# EAGLE board mmu6100x (EAGLE 6.6.0), part 1 of 2
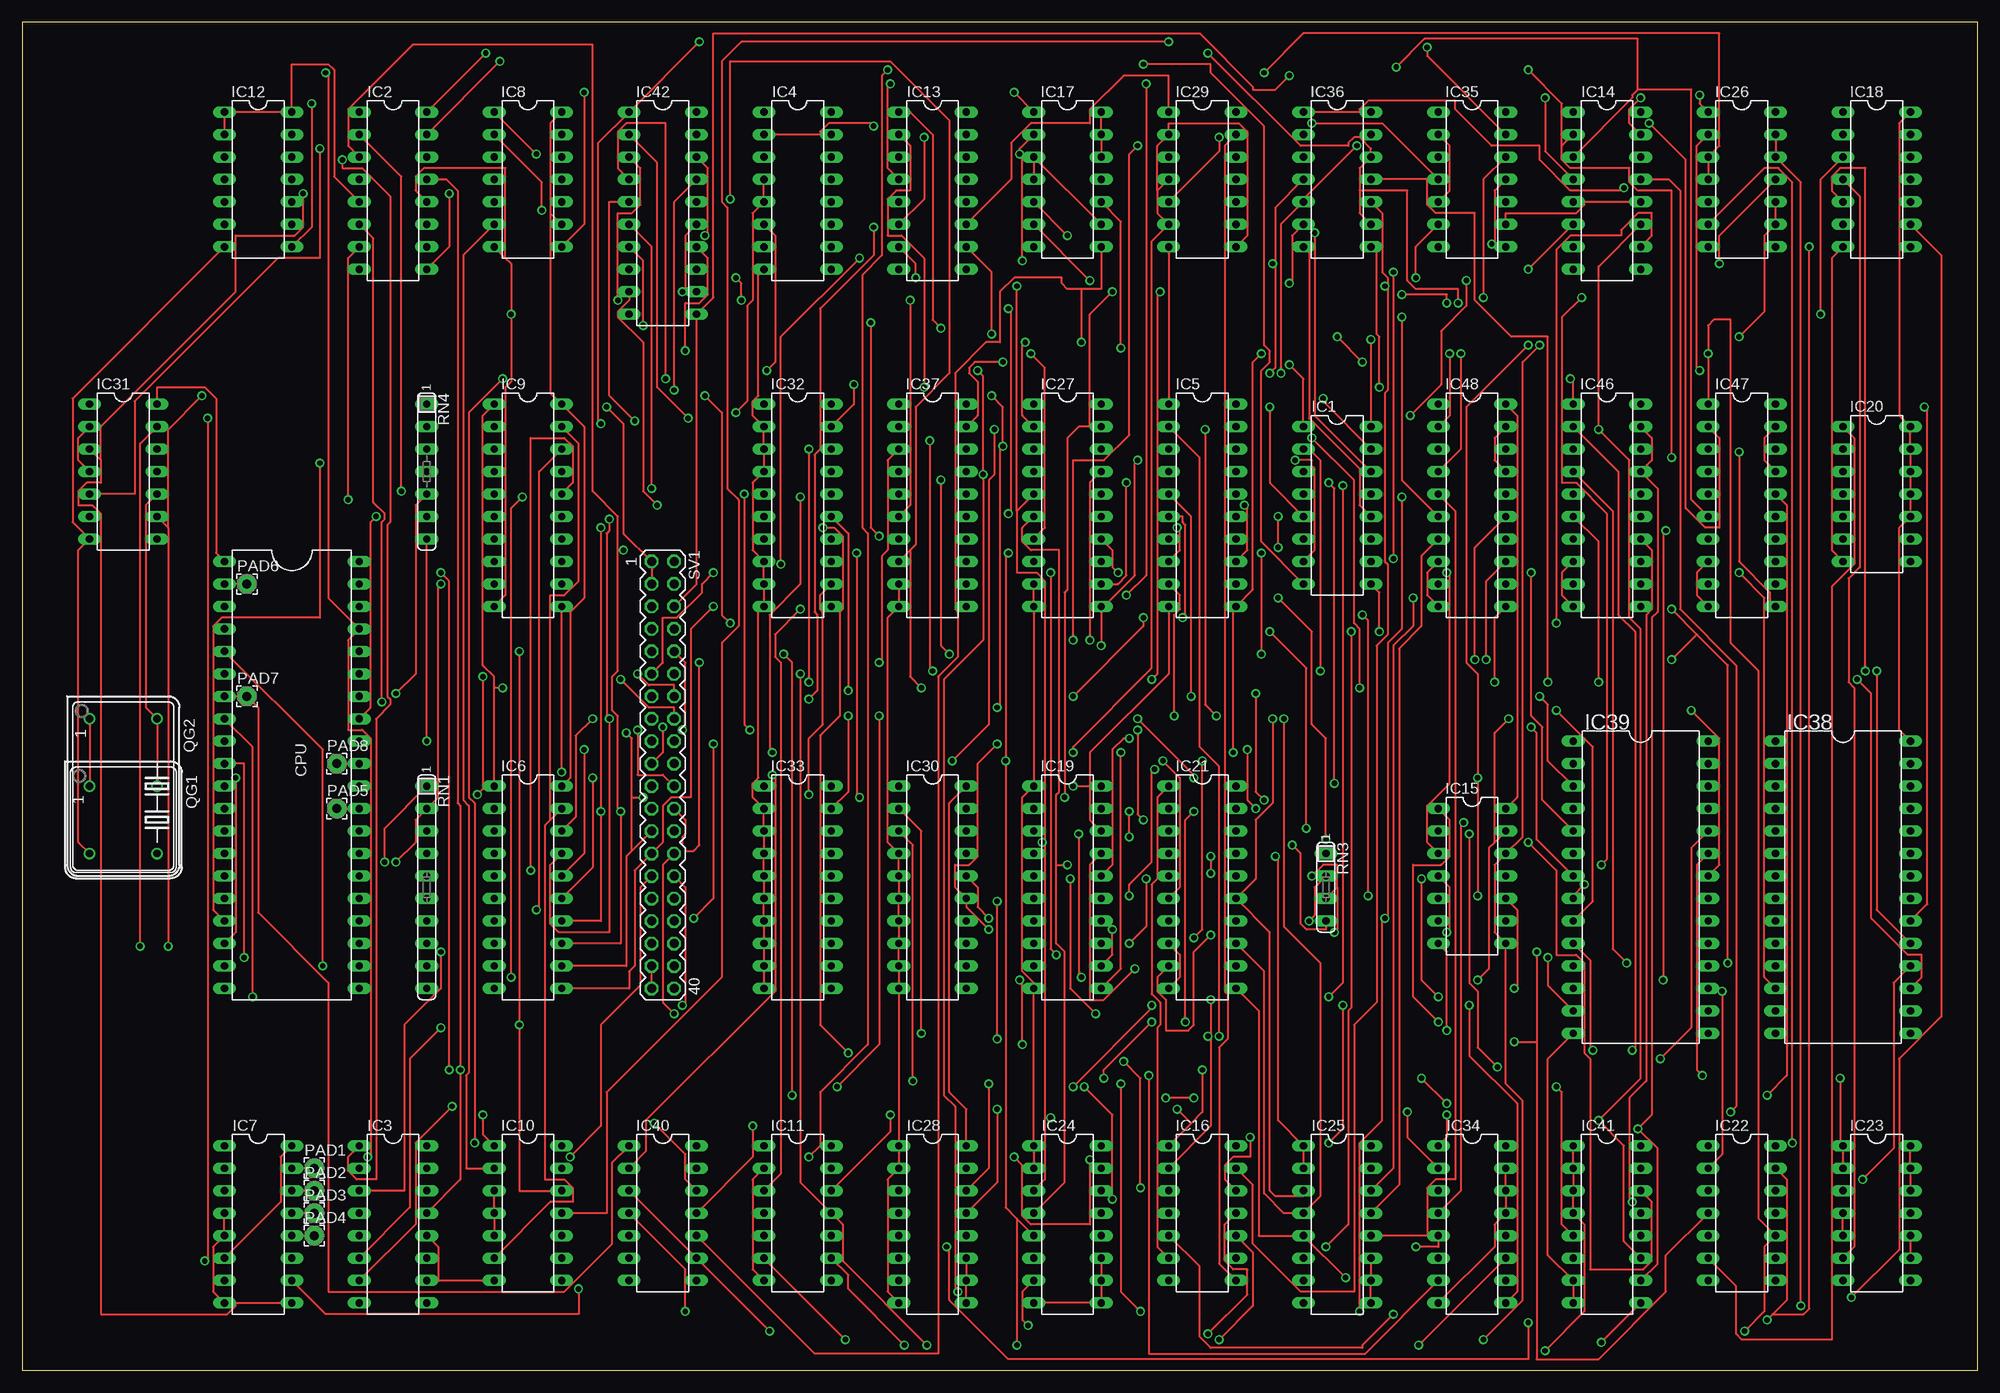
[diagram p3: board, top side]
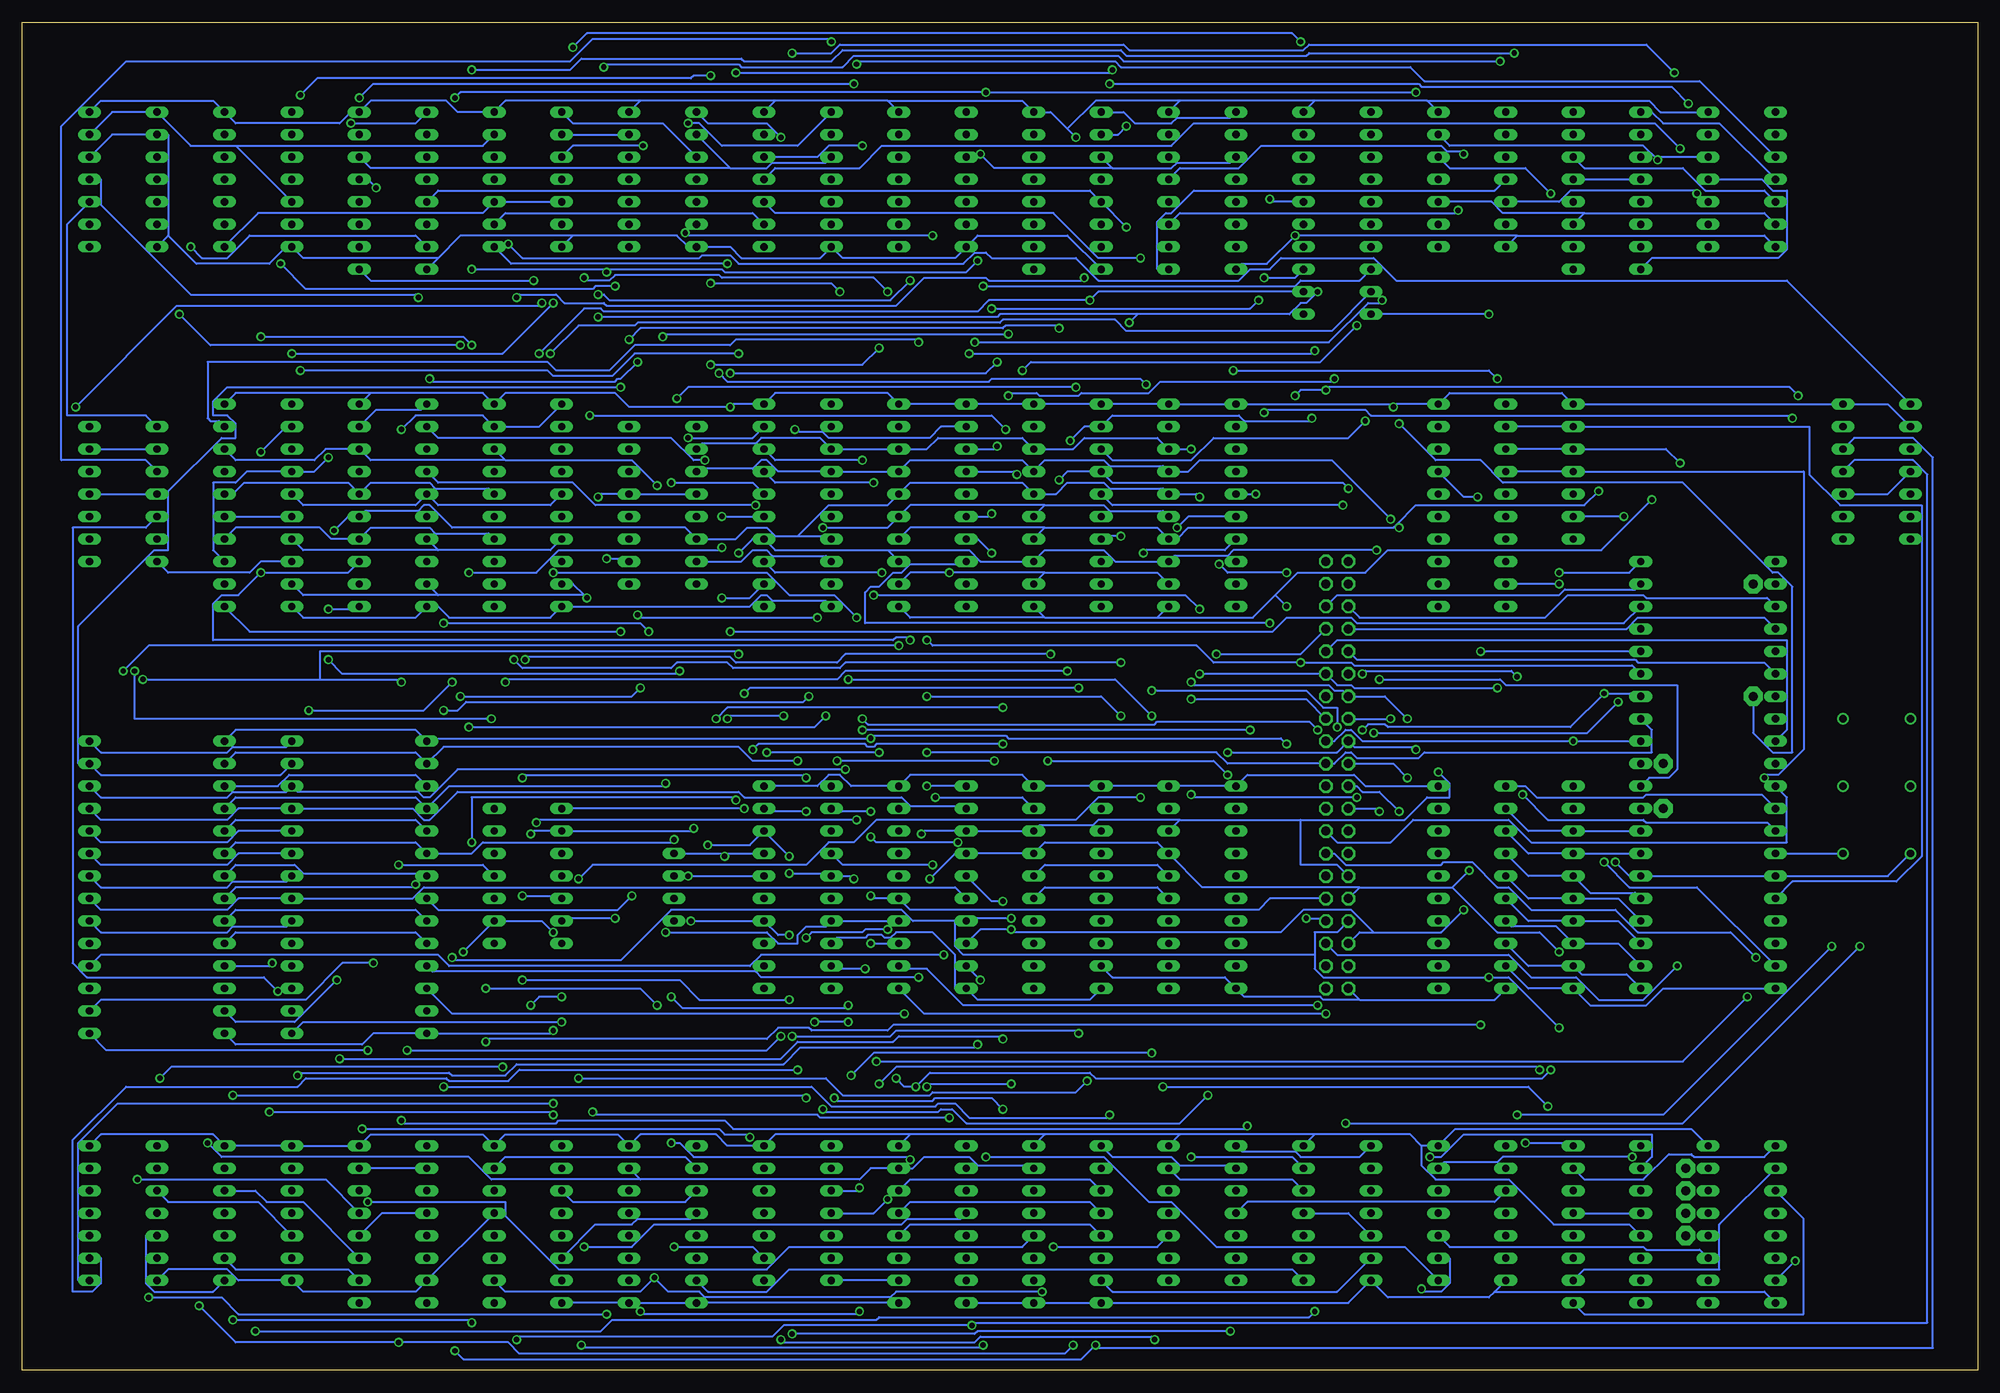
[diagram p4: board, bottom side, seen from below]

Size 220.98 x 152.4 mm. Coordinates in mm from the lower left corner, seen from the top.
Outline: 0,0 220.98,0 220.98,152.4 0,152.4 0,0
Copper layers (1*16): Top 0.035mm / dielectric 1.5mm / Bottom 0.035mm
Design rules "8mils *": minimum track width 10mil, minimum drill 24mil, track to track 8mil, track to pad 8mil, pad to pad 8mil, via to via 8mil, smd to smd 8mil, copper to edge 40mil, drill to drill 10mil, minimum pad ring 10mil, minimum via ring 8mil, stop-mask expansion 0mil, vias tented up to drill 0mil, thermal gap 10mil

## Footprints (pad centres in the part's own frame; a part is rotated, then mirrored left to right if it is on the bottom)
DIL40 = drill 0.813 long: 1 -24.13,-7.62; 2 -21.59,-7.62; 3 -19.05,-7.62; 4 -16.51,-7.62; 5 -13.97,-7.62; 6 -11.43,-7.62; 7 -8.89,-7.62; 8 -6.35,-7.62; 9 -3.81,-7.62; 10 -1.27,-7.62; 11 1.27,-7.62; 12 3.81,-7.62; 13 6.35,-7.62; 14 8.89,-7.62; 15 11.43,-7.62; 16 13.97,-7.62; 17 16.51,-7.62; 18 19.05,-7.62; 19 21.59,-7.62; 20 24.13,-7.62; 21 24.13,7.62; 22 21.59,7.62; 23 19.05,7.62; 24 16.51,7.62; 25 13.97,7.62; 26 11.43,7.62; 27 8.89,7.62; 28 6.35,7.62; 29 3.81,7.62; 30 1.27,7.62; 31 -1.27,7.62; 32 -3.81,7.62; 33 -6.35,7.62; 34 -8.89,7.62; 35 -11.43,7.62; 36 -13.97,7.62; 37 -16.51,7.62; 38 -19.05,7.62; 39 -21.59,7.62; 40 -24.13,7.62
DIL16 = drill 0.813 long: 1 -8.89,-3.81; 2 -6.35,-3.81; 3 -3.81,-3.81; 4 -1.27,-3.81; 5 1.27,-3.81; 6 3.81,-3.81; 7 6.35,-3.81; 8 8.89,-3.81; 9 8.89,3.81; 10 6.35,3.81; 11 3.81,3.81; 12 1.27,3.81; 13 -1.27,3.81; 14 -3.81,3.81; 15 -6.35,3.81; 16 -8.89,3.81
DIL20 = drill 0.813 long: 1 -11.43,-3.81; 2 -8.89,-3.81; 3 -6.35,-3.81; 4 -3.81,-3.81; 5 -1.27,-3.81; 6 1.27,-3.81; 7 3.81,-3.81; 8 6.35,-3.81; 9 8.89,-3.81; 10 11.43,-3.81; 11 11.43,3.81; 12 8.89,3.81; 13 6.35,3.81; 14 3.81,3.81; 15 1.27,3.81; 16 -1.27,3.81; 17 -3.81,3.81; 18 -6.35,3.81; 19 -8.89,3.81; 20 -11.43,3.81
DIL14 = drill 0.813 long: 1 -7.62,-3.81; 2 -5.08,-3.81; 3 -2.54,-3.81; 4 0,-3.81; 5 2.54,-3.81; 6 5.08,-3.81; 7 7.62,-3.81; 8 7.62,3.81; 9 5.08,3.81; 10 2.54,3.81; 11 0,3.81; 12 -2.54,3.81; 13 -5.08,3.81; 14 -7.62,3.81
DIL28-6 = drill 0.813 long: 1 -16.51,-7.62; 2 -13.97,-7.62; 3 -11.43,-7.62; 4 -8.89,-7.62; 5 -6.35,-7.62; 6 -3.81,-7.62; 7 -1.27,-7.62; 8 1.27,-7.62; 9 3.81,-7.62; 10 6.35,-7.62; 11 8.89,-7.62; 12 11.43,-7.62; 13 13.97,-7.62; 14 16.51,-7.62; 15 16.51,7.62; 16 13.97,7.62; 17 11.43,7.62; 18 8.89,7.62; 19 6.35,7.62; 20 3.81,7.62; 21 1.27,7.62; 22 -1.27,7.62; 23 -3.81,7.62; 24 -6.35,7.62; 25 -8.89,7.62; 26 -11.43,7.62; 27 -13.97,7.62; 28 -16.51,7.62
2,15/1,0 = drill 1.016 pad 2.159 octagon: 1 0,0
DIL08S = drill 0.813: 1 -3.81,-3.81; 4 3.81,-3.81; 5 3.81,3.81; 8 -3.81,3.81
DIL14S = drill 0.813: 1 -7.62,-3.81; 7 7.62,-3.81; 8 7.62,3.81; 14 -7.62,3.81
SIL10 = drill 0.813 long: 1 -11.43,0; 2 -8.89,0; 3 -6.35,0; 4 -3.81,0; 5 -1.27,0; 6 1.27,0; 7 3.81,0; 8 6.35,0; 9 8.89,0; 10 11.43,0
SIL4 = drill 0.813 long: 1 -3.81,0; 2 -1.27,0; 3 1.27,0; 4 3.81,0
SIL7 = drill 0.813 long: 1 -7.62,0; 2 -5.08,0; 3 -2.54,0; 4 0,0; 5 2.54,0; 6 5.08,0; 7 7.62,0
MA20-2 = drill 1.016 octagon: 1 -24.13,-1.27; 2 -24.13,1.27; 3 -21.59,-1.27; 4 -21.59,1.27; 5 -19.05,-1.27; 6 -19.05,1.27; 7 -16.51,-1.27; 8 -16.51,1.27; 9 -13.97,-1.27; 10 -13.97,1.27; 11 -11.43,-1.27; 12 -11.43,1.27; 13 -8.89,-1.27; 14 -8.89,1.27; 15 -6.35,-1.27; 16 -6.35,1.27; 17 -3.81,-1.27; 18 -3.81,1.27; 19 -1.27,-1.27; 20 -1.27,1.27; 21 1.27,-1.27; 22 1.27,1.27; 23 3.81,-1.27; 24 3.81,1.27; 25 6.35,-1.27; 26 6.35,1.27; 27 8.89,-1.27; 28 8.89,1.27; 29 11.43,-1.27; 30 11.43,1.27; 31 13.97,-1.27; 32 13.97,1.27; 33 16.51,-1.27; 34 16.51,1.27; 35 19.05,-1.27; 36 19.05,1.27; 37 21.59,-1.27; 38 21.59,1.27; 39 24.13,-1.27; 40 24.13,1.27

## Placement (x,y rotation side)
CPU  IM6100  [DIL40]  30.48,67.31 270 top
IC1  74LS75N  [DIL16]  148.59,97.79 270 top
IC2  74LS75N  [DIL16]  41.91,133.35 270 top
IC3  74LS75N  [DIL16]  41.91,16.51 270 top
IC4  74LS138N  [DIL16]  87.63,133.35 270 top
IC5  74LS373N  [DIL20]  133.35,97.79 270 top
IC6  74LS245N  [DIL20]  57.15,54.61 270 top
IC7  74LS138N  [DIL16]  26.67,16.51 270 top
IC8  74LS20N  [DIL14]  57.15,134.62 270 top
IC9  74LS245N  [DIL20]  57.15,97.79 270 top
IC10  74LS00N  [DIL14]  57.15,17.78 270 top
IC11  74LS74N  [DIL14]  87.63,17.78 270 top
IC12  74LS30N  [DIL14]  26.67,134.62 270 top
IC13  74LS138N  [DIL16]  102.87,133.35 270 top
IC14  74LS138N  [DIL16]  179.07,133.35 270 top
IC15  74LS08N  [DIL14]  163.83,55.88 270 top
IC16  74LS32N  [DIL14]  133.35,17.78 270 top
IC17  74LS32N  [DIL14]  118.11,134.62 270 top
IC18  74LS74N  [DIL14]  209.55,134.62 270 top
IC19  74LS373N  [DIL20]  118.11,54.61 270 top
IC20  74LS74N  [DIL14]  209.55,99.06 270 top
IC21  74LS241N  [DIL20]  133.35,54.61 270 top
IC22  74LS20N  [DIL14]  194.31,17.78 270 top
IC23  74LS00N  [DIL14]  209.55,17.78 270 top
IC24  74LS173N  [DIL16]  118.11,16.51 270 top
IC25  74LS173N  [DIL16]  148.59,16.51 270 top
IC26  74LS00N  [DIL14]  194.31,134.62 270 top
IC27  74LS245N  [DIL20]  118.11,97.79 270 top
IC28  74LS173N  [DIL16]  102.87,16.51 270 top
IC29  74LS07N  [DIL14]  133.35,134.62 270 top
IC30  74LS245N  [DIL20]  102.87,54.61 270 top
IC31  74LS74N  [DIL14]  11.43,101.6 270 top
IC32  74LS245N  [DIL20]  87.63,97.79 270 top
IC33  74LS245N  [DIL20]  87.63,54.61 270 top
IC34  74LS157N  [DIL16]  163.83,16.51 270 top
IC35  74LS32N  [DIL14]  163.83,134.62 270 top
IC36  74LS08N  [DIL14]  148.59,134.62 270 top
IC37  74LS245N  [DIL20]  102.87,97.79 270 top
IC38  62256P  [DIL28-6]  205.74,54.61 270 top
IC39  62256P  [DIL28-6]  182.88,54.61 270 top
IC40  74LS11N  [DIL14]  72.39,17.78 270 top
IC41  74LS151N  [DIL16]  179.07,16.51 270 top
IC42  74273N  [DIL20]  72.39,130.81 270 top
IC46  74LS244N  [DIL20]  179.07,97.79 270 top
IC47  74LS244N  [DIL20]  194.31,97.79 270 top
IC48  74LS244N  [DIL20]  163.83,97.79 270 top
PAD1  [2,15/1,0]  33.02,22.86 0 top
PAD2  [2,15/1,0]  33.02,20.32 0 top
PAD3  [2,15/1,0]  33.02,17.78 0 top
PAD4  [2,15/1,0]  33.02,15.24 0 top
PAD5  [2,15/1,0]  35.56,63.5 0 top
PAD6  [2,15/1,0]  25.4,88.9 0 top
PAD7  [2,15/1,0]  25.4,76.2 0 top
PAD8  [2,15/1,0]  35.56,68.58 0 top
QG1  [DIL08S]  11.43,62.23 270 top
QG2  [DIL14S]  11.43,66.04 270 top
RN1  100K  [SIL10]  45.72,54.61 270 top
RN3  100K  [SIL4]  147.32,54.61 270 top
RN4  [SIL7]  45.72,101.6 270 top
SV1  [MA20-2]  72.39,67.31 270 top

## Tracks (layer width: path | path; a pad name or v marks a point on that pad's centre or on a via)
!00  (via drill 0.61)
  Top 0.254: IC12.8 32.7,129.22 v32.7,143.19 | v98.11,145.41 97.79,145.1 97.79,135.89 IC13.4
  Bottom 0.254: v32.7,143.19 34.61,145.1 62.87,145.1 63.18,145.41 v98.11,145.41
!2X  (via drill 0.61)
  Top 0.254: IC8.8 63.5,129.54 v63.5,144.46 | IC17.1 v112.08,144.46 | IC14.4 172.09,137.79 v172.09,143.83
  Bottom 0.254: v63.5,144.46 v112.08,144.46 171.45,144.46 v172.09,143.83
!AND
  Top 0.254: PAD1.1 IC7.15
!C0  (via drill 0.61)
  Top 0.254: v45.72,71.12 RN4.7
  Bottom 0.254: CPU.32 v45.72,71.12 69.53,71.12 70.8,72.39 71.44,72.39 72.71,71.12 SV1.18
!C1  (via drill 0.61)
  Top 0.254: 128.27,133.35 128.27,130.81 IC29.6 127.64,127.64 127.64,79.38 118.75,70.48 v118.75,69.85 | IC29.4 128.27,133.35 | 128.27,133.35 128.27,138.43 IC29.2 129.54,140.97 137.48,140.97 138.43,140.02 138.43,128.27 IC29.8 | v40.01,96.52 39.37,95.89 39.37,74.93 CPU.33
  Bottom 0.254: CPU.33 36.83,72.39 36.83,69.85 62.55,69.85 63.18,69.22 70.17,69.22 70.8,69.85 71.44,69.85 72.71,68.58 SV1.20 84.77,68.58 86.04,69.85 v118.75,69.85 | v40.01,96.52 RN4.6
!C2  (via drill 0.61)
  Top 0.254: v42.23,76.52 44.45,78.74 44.45,97.79 RN4.5 | SV1.22 72.39,67.31 69.53,67.31 v69.53,72.39
  Bottom 0.254: CPU.34 38.42,76.52 v42.23,76.52 46.04,72.71 66.67,72.71 66.99,73.03 68.9,73.03 v69.53,72.39
!CAF  (via drill 0.61)
  Top 0.254: IC13.7 100.97,125.09 v100.97,123.51 | v165.1,121.28 165.1,134.62 IC35.12
  Bottom 0.254: v100.97,123.51 101.28,123.19 111.76,123.19 112.08,123.51 119.06,123.51 122.24,120.33 154.94,120.33 155.26,120.65 159.7,120.65 160.66,121.6 164.78,121.6 v165.1,121.28
!CDF  (via drill 0.61)
  Top 0.254: IC47.17 196.85,102.87 196.85,105.41 IC47.19 | IC40.10 89.53,1.91 103.5,1.91 103.5,78.42 105.73,80.64 105.73,85.72 105.41,86.04 105.41,112.71 108.9,116.2 110.49,116.2 110.49,121.92 112.08,123.51 117.47,123.51 117.47,122.87 118.11,122.24 119.7,122.24 | 119.7,122.24 121.92,122.24 IC17.8 | 119.7,122.24 v119.7,116.2
  Bottom 0.254: IC47.19 198.75,107.31 199.71,107.31 200.03,107.63 200.03,113.98 161.61,113.98 160.66,113.03 154.62,113.03 151.76,115.89 140.97,115.89 140.34,116.52 120.02,116.52 v119.7,116.2
!CIF  (via drill 0.61)
  Top 0.254: IC40.4 74.93,11.43 v74.93,6.67 | v194.63,4.45 196.85,6.67 196.85,13.97 IC22.10 196.22,17.14 196.22,79.06 193.04,82.23 193.04,118.75 191.13,118.75 190.5,118.11 v190.5,114.94 IC47.1 | v120.65,123.19 IC17.6 | v155.89,121.6 160.97,121.6 v160.97,120.65
  Bottom 0.254: v74.93,6.67 75.56,6.03 124.14,6.03 124.46,5.71 154.31,5.71 155.57,4.45 v194.63,4.45 | v120.65,123.19 122.87,120.97 154.62,120.97 155.26,121.6 v155.89,121.6 | v160.97,120.65 166.69,114.94 v190.5,114.94
!CINT  (via drill 0.61)
  Top 0.254: IC11.3 85.72,22.23 85.72,80.01 85.09,80.64 85.09,83.19 v87.95,86.04 | v124.78,87.63 127,89.85 v127,145.41 | v182.88,143.83 181.61,142.56 181.61,140.97 IC14.15
  Bottom 0.254: v87.95,86.04 89.53,87.63 v124.78,87.63 | v127,145.41 181.29,145.41 v182.88,143.83
!CPREQ  (via drill 0.61)
  Top 0.254: CPU.5 33.97,70.17 v33.97,45.72
  Bottom 0.254: v33.97,45.72 37.78,41.91 42.86,41.91 45.4,44.45 50.48,44.45 53.02,46.99 72.39,46.99 SV1.36
!CPSEL  (via drill 0.61)
  Top 0.254: IC23.2 IC23.1 205.42,25.72 v205.42,33.02 | v140.97,83.5 145.1,79.38 v145.1,61.28 | v166.69,34.29 164.47,36.51 164.47,42.86 163.51,43.81 v163.51,60.64
  Bottom 0.254: CPU.38 40.01,84.45 70.17,84.45 70.8,85.09 78.11,85.09 79.69,83.5 v140.97,83.5 | v145.1,61.28 145.41,60.96 IC15.2 163.19,60.96 v163.51,60.64 | v205.42,33.02 204.15,34.29 v166.69,34.29
!CPUINTREQ  (via drill 0.61)
  Top 0.254: CPU.8 26.04,70.48 v26.04,42.23 | v124.46,34.92 126.36,33.02 v126.36,20.64
  Bottom 0.254: v26.04,42.23 33.34,34.92 v124.46,34.92 | v126.36,20.64 126.68,20.32 IC16.3
!CUF  (via drill 0.61)
  Top 0.254: IC40.2 70.48,24.77 70.48,28.26 85.09,42.86 85.09,66.99 v84.77,67.31 | v105.09,68.9 109.22,73.03 109.22,100.65 109.86,101.28 v109.86,106.36 | v156.84,107.95 160.34,111.44 160.34,117.47 163.19,120.33 v163.19,123.19
  Bottom 0.254: v84.77,67.31 86.36,68.9 v105.09,68.9 | v109.86,106.36 111.44,107.95 v156.84,107.95 | v163.19,123.19 181.61,123.19 IC14.9
!DCA
  Top 0.254: PAD4.1 IC7.12
!DEVINTREQ  (via drill 0.61)
  Top 0.254: IC23.10 IC23.9 | 132.08,27.94 133.35,29.21 v133.35,33.97 | 132.08,27.94 IC16.1 | v86.04,80.96 87,80.01 v87,31.11 | 132.08,27.94 v130.49,29.53
  Bottom 0.254: v133.35,33.97 164.78,33.97 166.05,32.7 172.72,32.7 173.04,33.02 188.91,33.02 189.87,32.07 209.23,32.07 215.26,26.04 215.26,8.89 213.04,8.89 212.09,9.84 212.09,12.7 IC23.9 | SV1.8 76.52,80.96 v86.04,80.96 | v87,31.11 90.17,27.94 114.3,27.94 115.89,29.53 117.16,29.53 117.47,29.21 130.18,29.21 v130.49,29.53
!DEVSEL  (via drill 0.61)
  Top 0.254: v67.63,78.11 70.8,74.93 73.66,74.93 SV1.16 | v88.9,75.88 89.85,76.83 89.85,85.41 89.53,85.72 89.53,103.5 90.17,104.14 90.17,120.02 96.2,126.05 v96.2,129.22
  Bottom 0.254: CPU.30 37.15,66.99 34.92,66.99 33.97,67.94 33.97,77.47 53.34,77.47 53.98,78.11 v67.63,78.11 | IC14.5 173.99,133.35 100.33,133.35 IC13.5 v96.2,129.22 | SV1.16 75.88,75.88 v88.9,75.88
!DMAREQ
  Bottom 0.254: CPU.4 24.13,85.09 38.42,85.09 39.69,83.82 SV1.7
!DORTF  (via drill 0.61)
  Top 0.254: IC40.3 IC40.9 v84.45,4.45 | IC16.11 135.89,16.51 135.89,12.38 136.84,11.43 138.43,11.43 138.43,8.57 v133.99,4.13
  Bottom 0.254: v133.99,4.13 113.35,4.13 113.03,4.45 v84.45,4.45
!ERROR
  Top 0.254: IC10.5 IC10.4 IC10.3
  Bottom 0.254: IC11.4 82.55,19.05 54.61,19.05 IC10.3
!GTF  (via drill 0.61)
  Top 0.254: IC13.11 111.76,134.62 111.76,138.75 113.98,140.97 120.65,140.97 120.65,142.56 124.46,146.37 129.54,146.37 IC29.1 | IC35.4 153.67,140.97 v145.73,140.97
  Bottom 0.254: v145.73,140.97 144.46,140.97 141.92,138.43 133.35,138.43 IC29.1
!HLT  (via drill 0.61)
  Top 0.254: v58.1,137.48 IC8.1
  Bottom 0.254: v58.1,137.48 58.42,137.79 60.01,137.79 60.64,138.43 80.96,138.43 83.5,135.89 90.17,135.89 IC4.13
!INTCLR  (via drill 0.61)
  Top 0.254: v88.9,24.13 90.17,25.4 90.17,31.43 95.57,36.83 95.57,94.61 94.93,95.25 94.93,123.83 97.16,126.05 97.16,146.37 v97.79,147 | v140.34,146.69 144.78,151.13 191.77,151.13 191.77,138.43 IC26.3 IC26.4
  Bottom 0.254: IC40.13 77.47,24.13 v88.9,24.13 | v97.79,147 98.11,146.69 v140.34,146.69
!IO_RESET  (via drill 0.61)
  Top 0.254: v94.61,125.73 85.72,116.84 v85.72,91.12 | v78.11,90.17 76.83,88.9 76.83,87.95 73.98,85.09 72.39,85.09 72.39,80.01 SV1.11
  Bottom 0.254: IC29.10 135.89,130.81 104.46,130.81 99.38,125.73 v94.61,125.73 | v85.72,91.12 84.77,90.17 v78.11,90.17
!IOT  (via drill 0.61)
  Top 0.254: IC7.9 24.13,7.62 24.13,7.3 23.18,6.35 8.89,6.35 8.89,96.84 7.94,97.79 6.35,97.79 6.35,99.38 7.3,100.33 8.89,100.33 8.89,102.87 | IC31.3 8.89,102.87 | v31.75,133.03 31.75,129.22 30.8,128.27 24.13,128.27 24.13,121.92 8.89,106.68 8.89,102.87
  Bottom 0.254: IC8.5 47.31,132.08 46.04,133.35 32.07,133.35 v31.75,133.03
!IR3  (via drill 0.61)
  Top 0.254: IC3.1 36.83,24.13 36.83,22.54 37.78,21.59 40.01,21.59 40.01,73.66 41.59,75.25 41.59,75.88 41.27,76.2 41.27,95.57 41.59,95.89 41.59,132.72 38.42,135.89 36.2,135.89 v36.2,136.84
  Bottom 0.254: IC12.12 35.88,137.16 v36.2,136.84 37.78,138.43 59.69,138.43 IC8.13
!IR4
  Bottom 0.254: IC2.8 36.83,125.73 22.54,125.73 21.59,126.68 21.59,133.35 23.18,133.35 24.45,134.62 IC12.11
!IR5
  Bottom 0.254: IC12.6 24.13,130.81 44.45,130.81 | IC2.11 44.45,130.81 | IC8.10 54.93,132.08 53.66,130.81 44.45,130.81
!IR6
  Bottom 0.254: IC12.5 24.13,133.35 30.8,133.35 33.34,135.89 44.45,135.89 IC2.14
!IR7
  Bottom 0.254: IC12.4 29.21,140.97 35.56,140.97 36.83,142.24 IC2.1
!IR8  (via drill 0.61)
  Top 0.254: v126.68,147.64 134.3,147.64 134.3,146.69 140.34,140.65 140.34,115.89 140.97,115.25 140.97,113.98 140.02,113.03 140.02,93.66 IC1.8
  Bottom 0.254: IC12.3 31.43,145.73 62.55,145.73 64.14,147.32 96.84,147.32 97.47,147.96 126.36,147.96 v126.68,147.64
!IR10  (via drill 0.61)
  Top 0.254: IC1.14 146.05,107.95 v146.05,128.59 | IC17.5 v118.11,128.27
  Bottom 0.254: v146.05,128.59 145.73,128.27 v118.11,128.27
!IR11  (via drill 0.61)
  Top 0.254: IC17.10 124.14,129.86 v124.14,115.57 | v143.19,113.67 144.78,112.08 IC1.1
  Bottom 0.254: v124.14,115.57 126.05,113.67 v143.19,113.67
!ISZ
  Top 0.254: PAD3.1 IC7.13
!JMP  (via drill 0.61)
  Top 0.254: IC7.10 34.29,6.35 62.87,6.35 v62.87,9.21
  Bottom 0.254: v62.87,9.21 62.55,8.89 60.64,8.89 59.69,9.84 59.69,12.7 IC10.9
!JMS
  Bottom 0.254: IC7.11 31.43,13.65 37.47,13.65 37.78,13.97 59.69,13.97 IC10.10
!MEMSEL  (via drill 0.61)
  Top 0.254: v39.05,24.13 39.37,24.45 39.37,71.44 38.42,72.39 36.83,72.39 36.83,82.55 CPU.37 34.61,87.31 34.61,146.37 v34.29,146.69 | IC36.9 151.13,130.81 151.13,133.35 | 151.13,133.35 151.13,135.89 IC36.12 152.4,138.11 151.13,139.38 150.5,139.38 149.86,138.75 149.86,138.43 144.46,138.43 v133.99,148.91 | 151.13,133.35 156.53,133.35 156.53,123.19 157.48,122.24 162.24,122.24 v162.24,120.65 | v214.95,108.9 215.26,108.58 215.26,52.7 IC38.20
  Bottom 0.254: IC10.13 60.33,23.5 54.29,23.5 53.66,24.13 v39.05,24.13 | IC39.20 191.13,50.16 197.17,50.16 197.8,49.53 212.09,49.53 IC38.20 | v162.24,120.65 162.56,120.33 203.52,120.33 v214.95,108.9 | v34.29,146.69 37.47,149.86 75.56,149.86 76.2,149.22 95.89,149.22 96.52,149.86 128.59,149.86 129.54,148.91 v133.99,148.91
!OE  (via drill 0.61)
  Top 0.254: IC36.11 158.75,134.62 158.75,131.76 159.7,130.81 164.15,130.81 164.15,120.97 168.28,116.84 172.4,116.84 v172.4,77.79 | v188.59,74.61 191.77,71.44 191.77,57.15 IC39.22
  Bottom 0.254: IC39.22 191.13,55.24 197.17,55.24 197.8,54.61 212.09,54.61 IC38.22 | v172.4,77.79 175.58,74.61 v188.59,74.61
!OPR  (via drill 0.61)
  Top 0.254: v20.64,12.38 20.95,12.7 v20.95,107.63 | v80.64,108.27 81.92,109.54 81.92,120.33 82.55,120.97 82.55,130.81 IC4.5 IC4.4
  Bottom 0.254: v20.64,12.38 IC7.7 | v20.95,107.63 21.27,107.95 68.58,107.95 69.22,108.58 80.33,108.58 v80.64,108.27
!OSR  (via drill 0.61)
  Top 0.254: IC8.2 58.74,134.3 v58.74,131.13
  Bottom 0.254: v58.74,131.13 59.05,130.81 90.17,130.81 IC4.11
!OSRHLT
  Bottom 0.254: IC8.4 54.61,133.35 88.58,133.35 91.12,130.81 91.76,130.81 92.71,129.86 92.71,124.46 IC4.9
!RDF
  Bottom 0.254: IC29.3 130.18,136.53 136.21,136.53 136.84,135.89 140.97,135.89 | IC36.2 140.97,135.89 | IC14.14 181.61,135.89 140.97,135.89
!RESET  (via drill 0.61)
  Top 0.254: CPU.7 PAD7.1 26.67,74.93 26.67,51.75 34.61,43.81 34.61,8.89 61.28,8.89 66.67,14.29 66.67,23.5 IC40.1 | v65.41,107 65.09,107.31 65.09,138.75 IC42.1 v76.52,150.18 | IC35.13 158.75,148.59 v158.75,149.54
  Bottom 0.254: 196.85,138.43 IC26.5 | 196.85,138.43 201.93,138.43 IC18.1 210.82,142.24 IC18.13 | IC35.13 168.91,138.43 196.85,138.43 | IC40.1 69.85,24.13 76.52,24.13 77.15,24.77 83.19,24.77 IC11.1 | v65.41,107 61.28,102.87 56.2,102.87 53.66,100.33 33.34,100.33 23.18,90.17 22.54,90.17 20.95,88.58 20.95,69.85 23.18,69.85 25.4,72.07 PAD7.1 | v158.75,149.54 157.16,151.13 77.47,151.13 v76.52,150.18
!RIB
  Top 0.254: IC14.12 176.53,132.08 176.53,131.76 175.58,130.81 167.64,130.81 IC35.9
  Bottom 0.254: IC29.9 138.43,130.81 166.37,130.81 IC35.9
!RIF  (via drill 0.61)
  Top 0.254: IC29.5 135.25,137.79 v135.25,139.38 | IC34.1 160.97,26.35 v160.97,28.89 | v193.04,29.21 193.68,29.84 193.68,79.69 187.32,86.04 187.32,133.35 186.06,134.62 IC14.13 | IC36.1 151.13,142.24 151.13,142.56 152.08,143.51 161.93,143.51 161.93,142.56 166.05,138.43 171.45,138.43 171.45,136.84 174.94,133.35 180.97,133.35 v180.97,133.67
  Bottom 0.254: v135.25,139.38 136.84,140.97 143.51,140.97 IC36.1 | v160.97,28.89 161.29,29.21 v193.04,29.21 | v180.97,133.67 181.93,134.62 IC14.13
!RMF  (via drill 0.61)
  Top 0.254: IC48.17 166.37,102.87 166.37,105.41 IC48.19 | IC14.11 178.12,124.78 v178.12,106.36 181.61,102.87 181.61,85.09 182.88,83.82 182.88,33.02 v178.12,28.26 180.97,25.4 180.97,14.61 IC41.11 | IC40.11 82.55,24.13 v82.55,27.62
  Bottom 0.254: IC48.1 162.56,106.68 IC48.19 168.91,107.95 176.53,107.95 v178.12,106.36 | IC40.5 71.12,17.78 IC40.11 | IC41.11 189.23,19.05 193.36,19.05 194.63,20.32 IC22.12 | v82.55,27.62 82.87,27.3 140.65,27.3 141.6,28.26 160.34,28.26 160.66,27.94 177.8,27.94 v178.12,28.26
!RTF  (via drill 0.61)
  Top 0.254: IC16.12 135.89,21.59 135.89,23.18 136.84,24.13 138.75,24.13 v138.75,26.35 | IC41.10 184.78,12.06 184.78,25.08 v182.56,27.3 184.15,28.89 184.15,85.09 184.78,85.72 184.78,99.69 IC46.17 184.15,102.87 184.15,105.41 IC46.19 | IC13.10 109.54,124.14 v109.54,117.16 | v151.45,113.98 v148.59,116.84 | v174.94,112.08 175.26,111.76 IC46.1
  Bottom 0.254: IC41.10 184.15,11.43 196.85,11.43 IC22.9 | v138.75,26.35 139.06,26.67 141.6,26.67 142.24,27.3 v182.56,27.3 | IC46.1 175.9,108.58 180.97,108.58 IC46.19 | v109.54,117.16 148.27,117.16 v148.59,116.84 | v151.45,113.98 153.35,112.08 153.67,112.08 153.99,111.76 174.62,111.76 v174.94,112.08
!RUNHLT
  Bottom 0.254: CPU.6 24.13,80.01 38.42,80.01 38.73,80.33 70.17,80.33 SV1.9
!SETZF
  Top 0.254: IC22.6 193.68,9.53 193.68,4.13 194.31,3.49 204.47,3.49 204.47,88.58 207.01,91.12 207.01,105.41 IC20.1
  Bottom 0.254: IC18.10 215.9,129.54 215.9,107.95 207.01,107.95 IC20.1
!SINT  (via drill 0.61)
  Top 0.254: v147.32,13.97 149.86,16.51 149.86,40.64 150.18,40.96 v150.18,83.5 | v173.35,84.45 173.35,126.68 174.94,128.27 180.66,128.27 180.66,128.91 182.56,130.81 184.15,130.81 184.15,128.27 IC14.10
  Bottom 0.254: IC16.9 138.43,13.97 v147.32,13.97 | v150.18,83.5 151.13,84.45 v173.35,84.45
!SKP  (via drill 0.61)
  Top 0.254: v76.52,80.01 76.52,59.37 75.88,58.74 74.93,58.74 74.93,59.05 74.61,59.37 74.61,60.33 74.93,60.64 74.93,62.23 SV1.24 | v126.05,138.43 125.09,137.48 125.09,105.73 122.24,102.87 118.75,102.87 v118.75,82.55
  Bottom 0.254: CPU.35 39.05,79.69 70.48,79.69 70.8,80.01 v76.52,80.01 86.36,80.01 88.27,81.92 118.11,81.92 v118.75,82.55 | IC29.12 131.13,137.16 129.86,138.43 v126.05,138.43
!SUF  (via drill 0.61)
  Top 0.254: v104.46,13.97 104.78,13.65 104.78,7.94 111.44,1.27 170.18,1.27 v170.18,5.4 | 197.8,6.35 199.39,7.94 199.39,21.59 IC22.13 | 197.8,6.35 v197.17,5.71 | v201.93,127 201.93,6.99 201.29,6.35 197.8,6.35
  Bottom 0.254: IC11.10 92.71,13.97 v104.46,13.97 | v170.18,5.4 170.5,5.71 v197.17,5.71 | IC14.7 176.53,128.27 195.26,128.27 197.8,125.73 200.66,125.73 v201.93,127
!SWSEL
  Top 0.254: PAD8.1 CPU.31
!TAD
  Top 0.254: PAD2.1 IC7.14
!UIF  (via drill 0.61)
  Top 0.254: v93.03,3.49 IC11.6 | v135.25,3.49 139.06,7.3 139.06,13.34 IC16.10
  Bottom 0.254: v93.03,3.49 93.34,3.81 112.71,3.81 113.35,3.17 134.94,3.17 v135.25,3.49
!WAIT
  Bottom 0.254: CPU.11 21.59,64.77 21.59,59.69 50.48,59.69 53.02,62.23 63.82,62.23 66.36,59.69 72.39,59.69 SV1.26
!WE  (via drill 0.61)
  Top 0.254: IC36.8 153.03,126.36 153.03,117.16 153.35,116.84 v153.35,111.12
  Bottom 0.254: IC39.27 191.77,67.31 212.09,67.31 IC38.27 214.63,68.58 214.63,84.14 206.06,92.71 204.47,92.71 204.47,99.38 198.44,105.41 196.85,105.41 196.85,107 197.8,107.95 199.39,107.95 199.39,109.54 197.8,111.12 v153.35,111.12
!XTA
  Top 0.254: IC35.2 161.29,138.43 161.29,133.35 IC35.5
  Bottom 0.254: IC35.2 IC36.13 | IC35.5 IC35.10 168.91,130.81 194.31,130.81 IC26.8
!XTB  (via drill 0.61)
  Top 0.254: IC16.13 139.06,20.95 139.06,14.29 144.46,8.89 150.5,8.89 150.5,39.05 153.03,41.59 153.03,81.92 154.31,83.19 154.31,91.12 153.99,91.44 153.99,110.49 154.31,110.81 154.31,122.56 | 154.31,122.56 154.31,123.51 153.67,124.14 153.67,130.81 IC36.10 | IC26.11 191.77,128.27 v191.77,125.09 | 154.31,122.56 v153.99,122.56
  Bottom 0.254: v191.77,125.09 188.91,122.24 156.53,122.24 156.21,122.56 v153.99,122.56
BFLD0
  Bottom 0.254: IC28.5 100.33,16.51 120.65,16.51 IC24.12
BFLD1
  Bottom 0.254: IC28.4 100.33,19.05 120.65,19.05 IC24.13
BFLD2
  Bottom 0.254: IC28.3 100.33,21.59 120.65,21.59 IC24.14
BFLOAD
  Bottom 0.254: IC40.6 72.39,8.89 97.79,8.89 IC28.7
BMUX0  (via drill 0.61)
  Top 0.254: v181.93,19.05 181.61,19.37 181.61,30.8 183.51,32.7 183.51,85.41 184.15,86.04 184.15,92.71 IC46.14
  Bottom 0.254: IC28.12 107.95,13.97 134.3,13.97 136.84,11.43 160.34,11.43 166.37,17.46 166.37,19.05 v181.93,19.05 | IC48.14 168.28,94.61 174.31,94.61 174.94,95.25 181.61,95.25 IC46.14 186.06,93.98 187.32,95.25 196.85,95.25 IC47.14
BMUX1  (via drill 0.61)
  Top 0.254: IC28.13 110.17,21.27 v110.17,29.53 | v132.4,30.8 v129.22,30.8 | v197.17,31.11 199.39,33.34 199.39,97.79 IC47.16
  Bottom 0.254: IC48.16 168.28,99.69 174.31,99.69 174.94,100.33 181.61,100.33 IC46.16 184.15,100.33 195.9,100.33 197.17,99.06 IC47.16 | v110.17,29.53 111.44,30.8 117.79,30.8 118.11,30.48 128.91,30.48 v129.22,30.8 | v132.4,30.8 132.72,31.11 v197.17,31.11
BMUX2  (via drill 0.61)
  Top 0.254: IC28.14 109.22,22.86 v109.22,32.38 | v118.75,32.07 127.64,40.96 v127.64,41.27 | v147.64,42.23 149.22,43.81 v149.22,100.01
  Bottom 0.254: v109.22,32.38 118.43,32.38 v118.75,32.07 | v127.64,41.27 127.95,40.96 146.37,40.96 v147.64,42.23 | v149.22,100.01 152.08,102.87 166.37,102.87 | IC48.18 166.37,102.87 | 166.37,102.87 181.61,102.87 IC46.18 186.69,104.14 187.96,102.87 196.85,102.87 IC47.18
CPSEL
  Bottom 0.254: IC22.5 194.31,19.05 204.47,19.05 IC23.3
CPUDX0
  Bottom 0.254: CPU.16 20.95,55.24 9.21,55.24 6.35,58.1 6.35,97.79 15.56,97.79 19.05,101.28 19.05,106.68 RN4.2 IC9.2
CPUDX1  (via drill 0.61)
  Top 0.254: CPU.17 21.59,52.07 21.59,84.14 22.54,85.09 33.66,85.09 v33.66,102.55
  Bottom 0.254: v33.66,102.55 35.24,104.14 RN4.3 IC9.3
CPUDX2  (via drill 0.61)
  Top 0.254: CPU.18 24.13,49.53 v24.13,66.99
  Bottom 0.254: v24.13,66.99 23.81,67.31 22.54,67.31 19.68,70.17 19.68,101.6 RN4.4 IC9.4
CPUDX3  (via drill 0.61)
  Top 0.254: v42.23,57.47 44.45,59.69 44.45,62.23 RN1.2 46.99,64.77 46.99,88.58 v47.31,88.9
  Bottom 0.254: CPU.19 31.75,54.61 39.37,54.61 v42.23,57.47 | v47.31,88.9 IC9.9
CPUDX4
  Bottom 0.254: CPU.20 35.56,43.18 37.47,41.27 43.81,41.27 RN1.10 50.8,43.18 IC6.9
CPUDX5
  Bottom 0.254: CPU.21 39.69,44.77 44.77,44.77 RN1.9 50.8,45.72 IC6.8
CPUDX6
  Bottom 0.254: CPU.22 40.64,48.26 RN1.8 47.62,50.16 52.7,50.16 IC6.7
CPUDX7
  Bottom 0.254: CPU.23 40.64,50.8 RN1.7 50.8,50.8 IC6.6
CPUDX8
  Bottom 0.254: CPU.24 40.64,53.34 RN1.6 50.8,53.34 IC6.5
CPUDX9
  Bottom 0.254: CPU.25 38.73,53.98 43.81,53.98 RN1.5 50.8,55.88 IC6.4
CPUDX10
  Bottom 0.254: CPU.27 RN1.4 50.8,58.42 IC6.3
CPUDX11
  Bottom 0.254: CPU.28 RN1.3 50.8,60.96 IC6.2
DATAF  (via drill 0.61)
  Top 0.254: v47.31,90.17 48.26,89.22 v48.26,33.97 | v120.02,32.07 123.19,28.89 v123.19,19.37 | v132.4,63.18 131.44,62.23 v131.44,39.37 | v127.64,39.37 122.24,33.97 v122.24,33.02
  Bottom 0.254: CPU.40 39.37,90.17 v47.31,90.17 | v48.26,33.97 49.21,33.02 99.69,33.02 100.33,33.66 118.43,33.66 v120.02,32.07 121.28,32.07 v122.24,33.02 | v123.19,19.37 124.78,17.78 IC16.4 | IC21.19 136.84,63.18 v132.4,63.18 | v127.64,39.37 v131.44,39.37
DEVINTREQ  (via drill 0.61)
  Top 0.254: IC30.3 100.65,59.37 v100.65,32.7 | v160.97,30.16 v158.12,33.02
  Bottom 0.254: v100.65,32.7 101.92,31.43 118.11,31.43 118.43,31.11 128.27,31.11 130.18,33.02 v158.12,33.02 | v160.97,30.16 210.19,30.16 214.63,25.72 214.63,10.16 IC23.8
DFLD0  (via drill 0.61)
  Top 0.254: IC21.11 139.7,40.64 139.7,15.24 IC25.5 v149.54,10.48 | IC42.7 70.17,125.41 v70.17,118.11 | v107.95,113.03 108.58,112.39 v108.58,101.28 108.58,82.55 104.14,78.11 104.14,31.11 105.41,29.84 105.41,9.21 v105.73,8.89
  Bottom 0.254: IC34.10 166.37,8.89 151.13,8.89 v149.54,10.48 147.96,8.89 144.46,8.89 143.83,8.26 122.87,8.26 122.24,8.89 v105.73,8.89 | v70.17,118.11 74.3,113.98 107,113.98 v107.95,113.03 | v108.58,101.28 108.9,101.6 IC27.4
DFLD1  (via drill 0.61)
  Top 0.254: IC21.13 140.34,45.09 140.34,20 142.56,17.78 IC25.4 146.69,19.68 146.69,46.04 142.56,50.16 v142.56,73.66 | IC42.4 67.31,135.89 67.31,140.02 68.26,140.97 72.71,140.97 v72.71,112.08 | v109.54,110.17 110.81,108.9 v110.81,104.46 110.49,104.14 110.49,75.25 v110.17,74.93
  Bottom 0.254: IC25.4 145.41,17.14 151.45,17.14 152.08,16.51 156.21,16.51 IC34.6 | v72.71,112.08 73.03,111.76 92.39,111.76 93.66,110.49 101.28,110.49 101.6,110.17 106.05,110.17 106.36,110.49 109.22,110.49 v109.54,110.17 | v110.81,104.46 111.12,104.14 IC27.3 | v142.56,73.66 141.29,74.93 v110.17,74.93
DFLD2  (via drill 0.61)
  Top 0.254: IC25.3 144.78,19.68 141.6,19.68 140.97,20.32 140.97,49.53 IC21.15 139.38,55.56 139.38,62.23 141.29,64.14 v141.29,73.66 | IC42.3 69.85,135.89 69.85,131.76 68.9,130.81 67.31,130.81 v67.31,120.97 | v113.35,116.2 113.03,115.89 113.03,107.95 IC27.2 | v134.94,73.98 133.67,75.25 v133.67,106.36
  Bottom 0.254: IC25.3 146.05,19.05 158.75,19.05 IC34.3 | v67.31,120.97 67.63,120.65 68.9,120.65 73.34,116.2 v113.35,116.2 | v141.29,73.66 140.97,73.98 v134.94,73.98 | v133.67,106.36 133.35,106.05 130.49,106.05 129.86,105.41 118.43,105.41 117.16,106.68 IC27.2
DFLOAD
  Bottom 0.254: IC40.8 77.47,11.43 134.3,11.43 136.84,8.89 143.51,8.89 IC25.7
DMAGNT
  Bottom 0.254: CPU.3 23.81,87.31 37.47,87.31 37.78,87.63 46.35,87.63 48.9,85.09 69.85,85.09 SV1.5
DMUX0
  Top 0.254: IC25.12 158.75,15.24 158.75,20.64 159.7,21.59 161.93,21.59 161.93,97.16 IC48.5
  Bottom 0.254: IC48.5 161.29,97.79 173.99,97.79 IC46.5 176.53,97.79 189.23,97.79 IC47.5
DMUX1
  Top 0.254: IC25.13 155.57,20.95 155.57,81.6 158.12,84.14 158.12,92.08 IC48.7
  Bottom 0.254: 173.99,92.71 IC46.7 | 173.99,92.71 161.29,92.71 IC48.7 | IC47.7 189.23,92.71 173.99,92.71
DMUX2  (via drill 0.61)
  Top 0.254: IC25.14 154.94,22.86 154.94,81.92 157.16,84.14 v157.16,87.31
  Bottom 0.254: 157.48,87.63 158.75,88.9 IC48.9 | 173.99,87.63 IC46.9 | 157.48,87.63 173.99,87.63 | 157.48,87.63 v157.16,87.31 | IC47.9 189.23,87.63 173.99,87.63
DX0  (via drill 0.61)
  Top 0.254: IC15.1 161.29,62.23 161.29,58.1 160.34,57.15 157.16,57.15 157.16,42.23 v160.02,39.37 | v109.22,49.85 106.68,52.39 IC30.15 105.41,54.61 105.41,57.15 107,57.15 107.95,58.1 107.95,68.58 v110.17,70.8 | IC9.18 58.42,101.6 58.42,52.39 v58.1,52.07 | v139.38,63.5 138.43,64.45 v138.43,70.17
  Bottom 0.254: v160.02,39.37 189.23,39.37 IC39.15 | IC33.15 92.71,54.61 105.41,54.61 IC30.15 | IC19.8 112.71,49.85 v109.22,49.85 108.9,49.53 78.74,49.53 76.2,52.07 70.8,52.07 68.26,49.53 | v58.1,52.07 60.64,49.53 68.26,49.53 | 68.26,49.53 69.85,49.53 SV1.35 | v139.38,63.5 IC15.1 | v138.43,70.17 137.79,70.8 125.73,70.8 125.41,70.48 124.78,70.48 124.46,70.8 v110.17,70.8
DX1  (via drill 0.61)
  Top 0.254: v109.22,51.12 107.95,52.39 107.95,54.61 IC30.16 | IC39.13 172.4,43.5 v172.4,46.67 | IC3.6 43.81,18.41 43.81,35.24 v47.31,38.73 | v56.52,98.74 55.24,97.47 v55.24,44.45
  Bottom 0.254: IC33.16 92.71,57.15 105.41,57.15 IC30.16 | v109.22,51.12 113.98,51.12 IC19.7 115.57,50.8 | v172.4,46.67 172.09,46.35 153.35,46.35 147.64,52.07 121.6,52.07 120.33,50.8 115.57,50.8 | v47.31,38.73 53.02,44.45 v55.24,44.45 73.98,44.45 74.93,45.4 74.93,46.99 | 74.93,46.99 74.93,49.53 72.39,49.53 SV1.33 | IC9.17 58.1,98.74 v56.52,98.74 | 115.57,50.8 115.57,47.94 114.62,46.99 74.93,46.99
DX2  (via drill 0.61)
  Top 0.254: v121.28,40.32 118.43,43.18 v118.43,55.56 | IC3.3 43.18,20.32 43.18,39.05 47.31,43.18 v47.31,47.31 | IC9.16 62.23,100.33 62.23,104.46 61.28,105.41 57.47,105.41 v57.47,56.52
  Bottom 0.254: IC39.12 172.4,40.32 v121.28,40.32 | v118.43,55.56 115.57,58.42 IC19.4 IC30.17 105.41,59.69 92.71,59.69 IC33.17 87.63,54.61 69.85,54.61 | v47.31,47.31 49.53,49.53 54.29,49.53 59.37,54.61 | 69.85,54.61 59.37,54.61 | SV1.31 69.85,54.61 | 59.37,54.61 v57.47,56.52
DX3  (via drill 0.61)
  Top 0.254: v119.7,44.45 119.38,44.77 v119.38,60.64 | v60.96,67.63 IC9.11 | v61.91,24.13 65.41,27.62 65.41,39.05 69.85,43.5 69.85,54.61 SV1.29
  Bottom 0.254: IC39.11 174.62,45.09 138.11,45.09 137.48,44.45 v119.7,44.45 | v119.38,60.64 119.06,60.96 IC19.3 IC30.18 106.05,61.59 100.01,61.59 99.38,62.23 90.17,62.23 | v60.96,67.63 59.69,66.36 59.69,64.77 62.23,64.77 64.77,62.23 76.52,62.23 | 90.17,62.23 76.52,62.23 | IC33.18 90.17,62.23 | IC3.2 36.83,24.13 36.83,26.67 58.1,26.67 60.64,24.13 v61.91,24.13 | 76.52,62.23 76.52,57.15 72.39,57.15 SV1.29
DX4  (via drill 0.61)
  Top 0.254: IC6.11 68.58,43.18 68.58,45.09 69.22,45.72 69.22,56.52 SV1.27 72.39,59.69 72.39,63.82 73.34,64.77 75.56,64.77 75.56,83.82 v78.11,86.36 | IC38.19 209.55,52.07 v209.55,79.06 | 121.92,86.04 v121.92,81.92 | IC2.7 36.83,125.73 v36.83,98.42 | v126.05,102.87 125.73,102.55 125.73,89.85 121.92,86.04 | 121.92,86.04 IC27.11
  Bottom 0.254: 92.71,85.09 IC32.11 | 105.41,85.09 92.71,85.09 | IC37.11 105.41,85.09 | IC27.11 120.65,85.09 105.41,85.09 | v209.55,79.06 206.69,81.92 v121.92,81.92 | v36.83,98.42 42.55,92.71 66.67,92.71 69.22,90.17 76.83,90.17 79.38,87.63 | 79.38,87.63 81.92,85.09 92.71,85.09 | IC5.18 135.89,102.87 v126.05,102.87 | 79.38,87.63 v78.11,86.36
DX5  (via drill 0.61)
  Top 0.254: v207.96,21.59 211.46,25.08 211.46,43.81 IC38.18 | v124.78,100.33 124.78,89.85 123.83,88.9 IC27.12 | IC6.12 68.26,45.72 68.26,58.1 68.9,58.74 | SV1.25 68.9,58.74 | IC2.6 39.69,127.95 39.69,98.11 40.96,96.84 40.96,96.2 40.64,95.89 v40.64,75.56 | v68.26,72.07 68.9,71.44 68.9,64.77 | 68.9,58.74 68.9,64.77 | IC32.12 90.17,87.63 90.17,86.04 90.49,85.72 90.49,73.03 88.9,71.44 v88.9,65.09 | 68.9,64.77 v70.17,64.77 | v116.84,46.99 116.2,47.62 v116.2,90.17
  Bottom 0.254: IC41.13 186.69,21.59 v207.96,21.59 | IC32.12 92.71,90.17 105.41,90.17 | IC37.12 105.41,90.17 | IC27.12 120.65,90.17 v116.2,90.17 105.41,90.17 | IC5.17 135.89,100.33 v124.78,100.33 | v40.64,75.56 44.13,72.07 v68.26,72.07 | v88.9,65.09 88.58,64.77 v70.17,64.77 | IC38.18 212.09,46.99 173.99,46.99 172.72,45.72 138.75,45.72 137.48,46.99 v116.84,46.99
DX6  (via drill 0.61)
  Top 0.254: IC46.6 178.12,93.66 v178.12,77.79 | v207.33,78.11 208.91,76.52 208.91,51.12 213.04,46.99 214.63,46.99 214.63,44.45 IC38.17 | IC6.13 67.63,48.26 v67.63,63.18 67.31,63.5 67.31,73.98 66.67,74.61 66.67,78.42 67.31,79.06 67.31,92.71 | IC2.3 36.83,138.43 36.83,142.56 44.13,149.86 64.45,149.86 64.45,99.38 67.31,96.52 67.31,92.71 | 67.31,92.71 v67.94,92.71 | v140.02,92.39 v140.02,80.96
  Bottom 0.254: v178.12,77.79 178.44,78.11 187.32,78.11 | v207.33,78.11 187.32,78.11 | 123.19,92.71 IC27.13 | 123.19,92.71 135.89,92.71 IC5.14 138.43,93.98 v140.02,92.39 | 123.19,92.71 113.98,92.71 112.71,91.44 IC37.13 105.41,92.71 98.74,92.71 97.47,91.44 IC32.13 90.81,92.08 84.77,92.08 84.14,92.71 v67.94,92.71 | v67.63,63.18 67.94,63.5 SV1.23 | 187.32,78.11 187.32,81.28 140.34,81.28 v140.02,80.96
DX7  (via drill 0.61)
  Top 0.254: IC6.14 65.41,50.8 v65.41,63.18 v65.41,95.25 | v123.83,90.17 123.19,90.81 123.19,92.71 IC27.14 | IC2.2 42.86,134.94 v42.86,99.38 | v138.11,97.79 138.43,97.47 138.43,92.71 IC5.13 | v181.29,46.04 179.71,47.62 179.71,97.16 IC46.4
  Bottom 0.254: v65.41,63.18 67.63,65.41 69.53,65.41 70.17,66.04 SV1.21 | 105.41,95.25 92.71,95.25 IC32.14 90.49,93.98 89.22,95.25 66.04,95.25 65.72,95.57 | IC37.14 105.41,95.25 | IC27.14 120.65,95.25 105.41,95.25 | IC5.13 135.89,90.17 v123.83,90.17 | v42.86,99.38 44.45,97.79 63.5,97.79 65.72,95.57 | IC46.4 173.99,100.33 158.75,100.33 156.21,97.79 v138.11,97.79 | IC38.16 212.09,41.91 188.91,41.91 184.78,46.04 v181.29,46.04 | 65.72,95.57 v65.41,95.25
DX8  (via drill 0.61)
  Top 0.254: IC6.15 64.45,56.83 v64.45,66.99 | SV1.19 72.39,69.85 v72.39,72.71 | v93.34,76.83 93.34,94.61 IC32.15 | v143.83,102.87 145.73,102.87 145.73,102.23 146.05,101.92 146.05,92.71 IC1.7 | v181.93,36.2 182.25,36.51 182.25,83.5 180.34,85.41 180.34,101.6 IC46.2 | v130.49,95.25 130.81,94.93 130.81,92.71 IC5.8
  Bottom 0.254: v64.45,66.99 66.04,68.58 SV1.19 | IC32.15 92.08,97.16 98.11,97.16 98.74,97.79 105.41,97.79 | IC37.15 105.41,97.79 | 105.41,97.79 120.65,97.79 IC27.15 123.19,95.25 v130.49,95.25 | v72.39,72.71 72.39,74.93 73.98,74.93 75.88,76.83 v93.34,76.83 | IC5.8 130.18,92.08 136.21,92.08 136.84,92.71 138.43,92.71 139.7,91.44 IC1.7 | IC46.2 173.99,105.41 147.64,105.41 145.1,102.87 v143.83,102.87 | IC38.15 211.46,36.2 v181.93,36.2
DX9  (via drill 0.61)
  Top 0.254: IC6.16 63.5,58.42 v63.5,70.17 | v185.42,44.13 185.42,94.61 v185.74,94.93 | v84.77,69.85 84.45,70.17 84.45,85.41 87.95,88.9 v87.95,98.74
  Bottom 0.254: v63.5,70.17 63.82,70.48 70.48,70.48 SV1.17 72.39,69.85 v84.77,69.85 | IC5.7 129.86,94.3 133.35,94.3 | 133.35,94.3 135.89,94.3 136.84,95.25 139.06,95.25 140.34,93.98 IC1.6 146.05,95.25 172.4,95.25 174.94,97.79 175.58,97.79 176.21,97.16 182.25,97.16 IC46.15 184.15,96.52 v185.74,94.93 | IC38.13 196.85,39.37 190.18,39.37 v185.42,44.13 | 133.35,94.3 129.86,97.79 123.19,97.79 IC27.16 120.65,100.33 107.95,100.33 IC37.16 104.14,99.06 102.87,100.33 98.74,100.33 98.11,99.69 92.08,99.69 IC32.16 88.27,99.06 v87.95,98.74
DX10  (via drill 0.61)
  Top 0.254: v193.99,90.17 196.85,87.31 196.85,44.45 IC38.12 | IC6.17 59.69,57.15 59.69,50.48 60.64,49.53 66.36,49.53 v66.36,73.66 66.04,73.98 66.04,94.61 66.36,94.93 v66.36,96.2 | v120.65,82.55 120.65,100.33 IC27.17
  Bottom 0.254: IC46.13 184.15,90.17 v193.99,90.17 196.53,87.63 198.44,87.63 199.39,86.68 199.39,82.55 122.56,82.55 122.24,82.87 120.97,82.87 v120.65,82.55 | SV1.15 v66.36,73.66 | IC1.3 144.46,101.92 138.43,101.92 137.48,102.87 136.84,102.87 135.57,101.6 IC5.4 IC27.17 120.65,102.87 107.95,102.87 IC37.17 105.41,102.87 98.74,102.87 98.11,102.23 92.08,102.23 IC32.17 89.22,101.6 87.95,102.87 73.03,102.87 v66.36,96.2
DX11  (via drill 0.61)
  Top 0.254: 189.23,83.19 192.72,79.69 v192.72,46.04 | 189.23,83.19 v186.37,86.04 | IC6.18 62.55,62.55 62.55,71.75 v64.45,73.66 | v88.9,104.14 v88.9,77.79 | v186.37,80.33 189.23,83.19 | v146.69,79.06 146.69,102.87 145.41,104.14 IC1.2
  Bottom 0.254: IC46.11 183.2,86.04 v186.37,86.04 | v192.72,46.04 193.04,45.72 IC38.11 | v64.45,73.66 66.99,76.2 SV1.13 71.75,76.83 72.71,76.83 73.34,77.47 88.58,77.47 v88.9,77.79 | IC1.2 144.15,104.78 138.11,104.78 137.48,105.41 130.81,105.41 IC5.3 IC27.18 118.75,104.14 117.47,105.41 107.95,105.41 IC37.18 102.23,104.14 100.97,105.41 92.71,105.41 IC32.18 v88.9,104.14 | v186.37,80.33 184.78,78.74 147,78.74 v146.69,79.06
EMA0  (via drill 0.61)
  Top 0.254: IC19.16 123.19,57.15 123.19,70.17 124.46,71.44 v125.09,71.44 | v75.88,51.12 78.11,53.34 v78.11,70.8
  Bottom 0.254: IC38.1 196.85,72.39 176.53,72.39 IC39.1 174.94,71.44 v125.09,71.44 124.78,71.75 109.86,71.75 109.54,71.44 78.74,71.44 v78.11,70.8 | SV1.34 73.98,51.12 v75.88,51.12
EMA1  (via drill 0.61)
  Top 0.254: v127.95,67.94 127.64,67.63 127.64,57.47 125.09,54.93 v125.09,53.66
  Bottom 0.254: IC38.26 212.09,64.77 197.8,64.77 197.17,65.41 191.13,65.41 IC39.26 189.87,65.41 176.21,65.41 175.58,64.77 174.94,64.77 171.77,67.94 v127.95,67.94 | SV1.32 80.01,53.34 81.28,52.07 120.65,52.07 IC19.15 124.78,53.34 v125.09,53.66
EMA2  (via drill 0.61)
  Top 0.254: v74.61,41.27 74.93,41.59 74.93,54.61 SV1.30 | v133.35,68.9 133.35,49.85 v132.4,48.9 | v123.19,49.85 123.19,46.99 IC19.12
  Bottom 0.254: IC38.2 196.85,69.85 176.53,69.85 IC39.2 173.35,70.48 140.02,70.48 138.43,68.9 v133.35,68.9 | IC19.12 121.6,45.4 118.75,45.4 114.62,41.27 v74.61,41.27 | v132.4,48.9 131.76,49.53 126.05,49.53 125.73,49.85 v123.19,49.85
ERROR
  Top 0.254: IC10.6 59.69,19.05 62.23,19.05 62.23,20.64 61.28,21.59 59.05,21.59 59.05,61.59 59.69,62.23 | IC6.19 59.69,62.23 | IC9.19 62.87,104.78 62.87,89.22 61.28,87.63 59.69,87.63 59.69,62.23
FLD0  (via drill 0.61)
  Top 0.254: v145.41,50.8 146.05,51.44 146.05,54.61 RN3.2 | v125.73,45.4 122.24,41.91 120.65,41.91 120.65,57.15 IC19.17 | v134.3,49.21 132.4,47.31 132.4,39.05 131.76,38.42 129.22,38.42 129.22,41.91 128.27,42.86 128.27,44.45 IC21.9
  Bottom 0.254: v145.41,50.8 IC21.14 135.57,49.21 v134.3,49.21 | IC21.9 129.22,45.4 v125.73,45.4
FLD1  (via drill 0.61)
  Top 0.254: v145.73,55.88 147,57.15 148.59,57.15 148.59,54.61 | RN3.3 148.59,54.61 | v148.27,49.53 148.59,49.85 148.59,54.61
  Bottom 0.254: IC19.14 IC21.7 130.18,50.16 132.4,50.16 133.35,49.21 133.35,48.26 135.57,48.26 136.84,49.53 v148.27,49.53 | v145.73,55.88 IC21.16
FLD2  (via drill 0.61)
  Top 0.254: v125.09,48.26 127,50.16 v127,55.56 | v143.51,59.37 144.46,58.42 144.46,50.48 145.1,49.85 147.32,49.85 RN3.4 | v134.3,58.1 v134.3,56.2
  Bottom 0.254: v125.09,48.26 IC19.13 | v127,55.56 127.32,55.88 IC21.5 129.86,56.2 v134.3,56.2 | v143.51,59.37 138.75,59.37 IC21.18 v134.3,58.1
GND  (via drill 0.61)
  Top 0.254: IC19.18 120.65,62.23 120.65,66.04 | 120.65,66.04 120.65,69.85 129.54,78.74 IC5.10 | IC48.10 158.75,87.63 158.75,90.17 IC48.8 | IC46.10 173.99,87.63 173.99,90.17 IC46.8 | IC47.10 189.23,87.63 189.23,90.17 IC47.8 | IC29.7 IC5.1 | IC1.12 151.13,97.79 151.13,101.92 145.41,107.63 145.41,126.36 IC36.7 | IC20.7 204.47,92.71 204.47,125.73 IC18.7 | RN1.1 40.96,61.28 v40.96,57.47 | QG2.7 6.35,59.69 6.35,92.71 IC31.7 5.71,95.89 5.71,109.86 IC12.7 | IC4.8 83.19,123.83 83.19,110.17 82.55,109.54 82.55,107.95 IC32.2 IC32.3 IC32.4 82.55,100.33 82.55,92.71 IC32.8 IC32.9 IC32.10 83.19,85.72 83.19,66.99 82.55,66.36 82.55,64.77 IC33.2 IC33.3 IC33.4 IC33.5 IC33.6 IC33.7 IC33.8 IC33.9 IC33.10 | IC42.18 77.47,135.89 77.47,128.59 v77.15,128.27 | IC9.10 54.61,87.63 54.61,111.12 55.24,111.76 v55.24,119.38 55.24,125.09 54.61,125.73 | IC8.7 54.61,125.73 | IC2.12 44.45,133.35 44.45,134.94 45.4,135.89 54.61,135.89 54.61,125.73 | IC15.7 160.97,47.31 v160.97,38.42 | IC41.8 IC41.7 172.4,13.02 172.4,35.24 IC39.14 | IC25.11 IC25.10 IC25.9 | IC25.2 IC25.1 141.92,28.26 141.92,57.78 v141.6,58.1 | IC34.15 IC34.14 IC34.13 166.37,16.51 166.37,13.97 IC34.8 | IC27.9 IC27.10 IC19.1 113.03,64.77 113.03,45.09 114.3,43.81 IC19.10 IC24.1 IC24.2 | IC21.10 130.81,44.45 130.81,46.99 IC21.8 | IC7.8 21.59,8.89 21.59,13.97 IC7.5 IC7.4 | IC10.7 46.99,10.16 46.99,13.97 IC3.12 | SV1.39 SV1.37 | IC37.9 IC37.10 97.79,85.09 97.79,59.69 IC30.4 IC30.5 IC30.6 IC30.7 IC30.8 IC30.9 IC30.10 IC28.1 IC28.2 97.79,21.59 97.79,8.89 IC28.8 | IC28.11 IC28.10 IC28.9 | IC24.8 IC24.9 IC24.10 IC24.11 | IC11.7 82.55,11.43 82.55,21.59 IC11.2
  Top 0.254: v118.75,66.04 120.65,66.04
  Bottom 0.254: IC20.7 204.47,90.17 195.26,90.17 193.99,91.44 IC47.8 | IC47.10 189.23,85.09 176.53,85.09 IC46.10 173.99,86.36 172.72,85.09 161.29,85.09 IC48.10 138.75,86.36 137.48,87.63 136.84,87.63 136.21,87 130.18,87 IC5.10 | IC13.8 102.87,128.27 113.03,128.27 IC17.7 115.57,125.73 128.27,125.73 IC29.7 130.81,125.73 139.7,125.73 140.97,127 IC36.7 145.73,127 147,128.27 158.75,128.27 | 204.47,128.27 IC18.7 | 204.47,128.27 204.47,139.7 IC18.2 210.82,139.7 IC18.12 | 158.75,128.27 IC35.7 | 173.99,125.73 171.45,128.27 158.75,128.27 | 173.99,125.73 IC14.8 | 173.99,125.73 189.23,125.73 IC26.7 191.13,127 193.04,125.09 201.29,125.09 204.47,128.27 | QG2.7 10.16,55.88 CPU.15 CPU.26 39.37,55.88 v40.96,57.47 | IC4.8 83.19,125.09 80.33,125.09 v77.15,128.27 52.07,128.27 | v55.24,119.38 IC42.10 | IC12.7 24.13,128.27 52.07,128.27 | IC8.7 52.07,128.27 | v160.97,38.42 161.29,38.1 IC39.14 181.29,38.1 182.56,36.83 196.85,36.83 IC38.14 | IC23.7 204.47,11.43 197.8,11.43 196.53,10.16 IC22.7 189.23,8.89 176.53,8.89 IC41.7 IC34.13 | IC34.8 IC25.9 IC25.8 IC24.9 | RN3.1 141.6,58.42 | 141.6,58.42 IC21.17 | IC25.2 146.05,24.13 166.37,24.13 IC34.15 | v141.6,58.1 141.6,58.42 | IC21.8 128.91,48.9 125.73,48.9 125.41,49.21 123.83,49.21 123.51,48.9 122.87,48.9 122.24,49.53 118.11,49.53 115.57,46.99 115.57,43.18 IC19.10 113.03,41.91 100.33,41.91 IC30.10 | IC10.7 54.61,8.89 | 54.61,8.89 55.24,8.26 66.67,8.26 IC40.7 71.12,7.62 IC28.8 IC28.9 IC24.8 | IC7.8 24.13,8.89 54.61,8.89 | IC6.10 54.61,41.91 69.85,41.91 | SV1.39 69.85,41.91 | 69.85,41.91 73.98,41.91 74.3,42.23 82.87,42.23 IC33.10 85.09,44.45 97.79,44.45 IC30.9
  Bottom 0.254: IC24.10 IC16.7 | IC11.2 84.14,23.18 90.17,23.18 91.12,24.13 97.79,24.13 IC28.1 | IC19.1 v118.75,66.04
IFETCH  (via drill 0.61)
  Top 0.254: IC15.4 161.29,54.61 161.29,49.85 v160.97,49.53 | IC22.4 185.74,13.02 185.74,8.89 178.12,1.27 171.13,1.27 171.13,37.15 | v171.13,47.31 171.13,37.15 | IC10.12 56.2,20.32 v56.2,39.05 v56.2,81.28 | v168.59,37.15 171.13,37.15
  Bottom 0.254: v160.97,49.53 162.24,50.8 IC15.9 v171.13,47.31 | CPU.36 v56.2,81.28 | v168.59,37.15 168.28,37.47 136.84,37.47 135.57,38.73 132.08,38.73 131.76,38.42 123.19,38.42 122.56,39.05 v56.2,39.05
IFLD0  (via drill 0.61)
  Top 0.254: 112.39,17.14 111.12,18.41 v111.12,68.9 111.12,92.08 v111.44,92.39 | 112.39,17.14 IC24.5 | v157.8,2.86 IC34.11 | 112.39,17.14 v112.39,2.86 | IC21.6 130.81,54.61 130.81,66.99 v128.91,68.9 | IC42.14 77.47,125.73 77.47,121.6 76.52,120.65 74.93,120.65 v74.93,115.25 | v113.98,114.94 115.57,113.35 115.57,95.25 IC27.7
  Bottom 0.254: v111.44,92.39 113.03,93.98 IC27.7 | v157.8,2.86 157.48,2.54 112.71,2.54 v112.39,2.86 | v111.12,68.9 v128.91,68.9 | v74.93,115.25 75.25,114.94 v113.98,114.94
IFLD1  (via drill 0.61)
  Top 0.254: v157.48,13.97 160.02,13.97 IC34.5 | IC27.6 113.03,95.25 113.03,93.66 113.98,92.71 117.16,92.71 117.16,65.41 116.84,65.09 116.84,57.15 | 116.84,57.15 116.84,48.26 117.79,47.31 117.79,21.27 IC24.4 | v80.64,123.51 81.28,122.87 v81.28,120.97 | v111.44,120.02 111.76,119.7 111.76,97.16 v111.44,96.84 | 116.84,57.15 v118.11,57.15
  Bottom 0.254: IC24.4 114.94,17.14 120.97,17.14 121.6,16.51 149.54,16.51 152.08,13.97 v157.48,13.97 | IC42.13 77.15,123.51 v80.64,123.51 | v81.28,120.97 82.23,120.02 v111.44,120.02 | v111.44,96.84 111.76,96.52 IC27.6 | IC21.4 128.27,57.15 v118.11,57.15
IFLD2  (via drill 0.61)
  Top 0.254: IC24.3 115.57,21.59 115.57,28.57 | 115.57,59.69 115.57,89.22 114.62,90.17 112.39,90.17 112.39,97.16 | 115.57,59.69 115.57,28.57 | IC27.5 112.39,97.16 | v125.09,60.33 v125.09,63.18 | 115.57,59.69 v115.25,59.69 | 112.39,97.16 v112.39,122.56 | IC34.2 156.53,26.35 v156.53,29.21 | 115.57,28.57 v116.2,28.57
  Bottom 0.254: IC21.2 129.22,63.18 v125.09,63.18 | v125.09,60.33 124.46,59.69 v115.25,59.69 | IC42.8 69.85,123.19 76.52,123.19 77.15,122.56 v112.39,122.56 | v156.53,29.21 156.21,28.89 131.13,28.89 130.81,28.57 v116.2,28.57
INHIBIT  (via drill 0.61)
  Top 0.254: IC16.2 134.3,27.62 134.3,37.78 | v134.3,41.91 134.3,37.78 | v164.47,44.13 165.74,45.4 165.74,59.05 166.37,59.69 | IC15.13 166.37,59.69 | IC30.2 101.6,60.96 v101.6,38.1 | 134.3,37.78 v133.99,37.78 | IC18.5 204.47,133.35 204.47,134.94 205.42,135.89 208.28,135.89 v208.28,79.06 | v167.96,73.66 166.37,72.07 166.37,59.69
  Bottom 0.254: v134.3,41.91 144.46,41.91 146.69,44.13 v164.47,44.13 | v101.6,38.1 101.92,38.42 122.24,38.42 122.87,37.78 v133.99,37.78 | v208.28,79.06 208.28,73.66 v167.96,73.66
INTCLR  (via drill 0.61)
  Top 0.254: IC26.6 196.85,135.89 198.44,135.89 200.03,134.3 v200.03,25.72
  Bottom 0.254: IC28.15 107,23.18 113.03,23.18 113.98,24.13 119.06,24.13 120.33,22.86 IC24.15 125.09,22.86 126.36,21.59 151.13,21.59 | 151.13,21.59 IC25.15 | v200.03,25.72 198.44,24.13 170.5,24.13 167.96,21.59 151.13,21.59
INTGNT  (via drill 0.61)
  Top 0.254: SV1.6 76.2,88.9 IC42.11 78.11,121.28 78.11,151.13 133.03,151.13 139.06,145.1 139.06,144.78 141.6,144.78 v143.19,146.37 | IC26.1 189.55,143.19 v189.55,144.15
  Bottom 0.254: CPU.39 38.73,88.27 46.67,88.27 47.31,87.63 72.39,87.63 SV1.6 | v189.55,144.15 187.64,146.05 145.41,146.05 145.1,146.37 v143.19,146.37
IR0
  Bottom 0.254: IC7.3 19.68,17.14 19.68,6.35 44.45,6.35 IC3.9
IR1
  Bottom 0.254: IC7.2 29.21,16.51 29.21,11.43 44.45,11.43 IC3.10
IR2
  Bottom 0.254: IC7.1 24.13,24.13 32.07,24.13 32.38,24.45 34.92,24.45 37.78,21.59 44.45,21.59 IC3.15
IR3  (via drill 0.61)
  Top 0.254: v51.12,25.72 51.12,64.14 50.48,64.77 50.48,108.27 v54.29,112.08 | v84.14,113.03 85.09,113.98 85.09,128.27 IC4.6
  Bottom 0.254: IC3.16 46.04,25.72 v51.12,25.72 | v54.29,112.08 55.24,113.03 v84.14,113.03
IR4  (via drill 0.61)
  Top 0.254: IC2.9 48.26,127 v48.26,133.03
  Bottom 0.254: v48.26,133.03 51.12,135.89 59.69,135.89 IC8.12
IR6  (via drill 0.61)
  Top 0.254: IC14.3 181.93,143.83 181.93,144.15 182.56,144.78 | 182.56,144.78 188.59,144.78 188.59,98.42 IC47.6 | v53.98,147.96 IC2.15 | v155.26,147.32 158.43,150.5 182.56,150.5 182.56,144.78
  Bottom 0.254: IC47.15 IC47.6 | v53.98,147.96 96.52,147.96 97.16,148.59 127,148.59 128.27,147.32 139.7,147.32 140.02,147.64 154.94,147.64 v155.26,147.32
IR7  (via drill 0.61)
  Top 0.254: 173.99,138.43 IC14.2 | 173.99,138.43 173.99,136.84 174.94,135.89 181.61,135.89 181.61,134.3 182.56,133.35 186.37,133.35 v186.37,103.19 | v52.39,148.91 IC2.16 | v170.18,147 173.99,143.19 173.99,138.43
  Bottom 0.254: IC47.13 199.39,92.71 199.39,100.33 196.85,100.33 195.58,101.6 IC47.4 187.96,101.6 v186.37,103.19 | v52.39,148.91 75.56,148.91 75.88,148.59 96.2,148.59 96.84,149.22 128.27,149.22 129.54,147.96 139.38,147.96 139.7,148.27 157.8,148.27 159.07,147 v170.18,147
IR8  (via drill 0.61)
  Top 0.254: IC47.11 197.49,87 197.49,87.95 193.99,91.44 v193.99,103.82 | IC1.9 153.35,87.95 v153.35,83.5 | v183.83,140.97 187.96,136.84 187.96,97.47 190.18,95.25 191.77,95.25 191.77,105.41 IC47.2
  Bottom 0.254: v193.99,103.82 191.13,106.68 IC47.2 | v153.35,83.5 195.26,83.5 IC47.11 | IC14.1 176.53,140.97 v183.83,140.97
IR9  (via drill 0.61)
  Top 0.254: IC17.2 112.71,138.11 v112.71,137.48 113.03,137.16 v113.03,125.41 | v154.94,124.14 v154.94,91.76 | IC14.6 v170.18,124.46
  Bottom 0.254: IC4.3 84.45,136.53 90.49,136.53 91.12,135.89 97.79,135.89 | IC13.3 97.79,135.89 | v112.71,137.48 111.12,135.89 97.79,135.89 | IC1.10 152.72,91.76 v154.94,91.76 | v170.18,124.46 155.26,124.46 | v113.03,125.41 114.3,124.14 141.6,124.14 141.92,124.46 155.26,124.46 | 155.26,124.46 v154.94,124.14
IR10  (via drill 0.61)
  Top 0.254: IC1.15 147,109.54 v147,109.86 | v101.92,111.12 101.92,125.73 99.38,128.27 97.79,128.27 97.79,132.4 98.74,133.35 100.33,133.35 100.33,138.43 IC13.2 | IC4.2 90.17,139.7 90.17,140.02 91.12,140.97 96.2,140.97 v96.2,140.65
  Bottom 0.254: v147,109.86 145.73,111.12 v101.92,111.12 | v96.2,140.65 97.16,139.7 IC13.2
IR11  (via drill 0.61)
  Top 0.254: v152.4,116.52 IC1.16 | v103.82,117.79 102.87,118.75 102.87,139.7 100.33,142.24 IC13.1
  Bottom 0.254: IC4.1 84.45,141.6 90.49,141.6 91.12,140.97 95.25,140.97 96.52,142.24 IC13.1 | v152.4,116.52 151.13,117.79 110.17,117.79 109.86,118.11 104.14,118.11 v103.82,117.79
JMP_OR_JMS  (via drill 0.61)
  Top 0.254: v112.08,24.13 113.03,23.18 113.03,17.46 113.98,16.51 120.65,16.51 v120.65,23.81 | v147.64,25.72 149.22,27.3 v149.22,41.27 | v168.59,43.18 168.91,43.5 168.91,52.07 IC15.10
  Bottom 0.254: IC10.8 64.77,13.97 86.04,13.97 91.12,19.05 93.66,19.05 98.74,24.13 v112.08,24.13 | v120.65,23.81 120.97,24.13 145.1,24.13 146.69,25.72 v147.64,25.72 | v149.22,41.27 151.13,43.18 v168.59,43.18
JMPDONE  (via drill 0.61)
  Top 0.254: IC18.3 203.2,134.62 v203.2,119.38 | v171.45,115.89 169.54,113.98 169.54,60.33 IC15.12 166.37,57.15 166.37,49.53 IC15.8 167.64,32.38 169.54,30.48 169.54,7.94 v165.1,3.49 | v113.67,5.08 113.03,5.71 113.03,8.89 IC24.7
  Bottom 0.254: v203.2,119.38 199.71,115.89 v171.45,115.89 | IC31.11 13.97,102.87 7.3,102.87 5.71,101.28 5.71,5.4 113.35,5.4 v113.67,5.08 134.94,5.08 136.21,3.81 164.78,3.81 v165.1,3.49
LINK
  Top 0.254: PAD5.1 CPU.29
LXMAR  (via drill 0.61)
  Top 0.254: CPU.10 25.08,68.58 v25.08,46.67 | v73.66,40.32 72.39,41.59 72.39,57.15 SV1.28 | v136.84,69.85 136.84,86.04 IC5.11 139.06,88.27 139.06,113.98 v140.02,114.94 | v124.14,69.85 124.14,45.4 IC19.11 | IC26.2 189.23,138.43 189.23,113.35 v189.55,113.03
  Bottom 0.254: v25.08,46.67 27.94,49.53 38.42,49.53 40.96,52.07 50.48,52.07 53.02,54.61 54.29,54.61 57.15,57.47 60.33,57.47 60.64,57.15 71.44,57.15 72.71,58.42 SV1.28 | IC19.11 119.06,40.32 v73.66,40.32 | v124.14,69.85 v136.84,69.85 | v189.55,113.03 161.61,113.03 160.97,112.39 154.31,112.39 151.76,114.94 v140.02,114.94
MA0  (via drill 0.61)
  Top 0.254: v112.71,44.13 113.03,43.81 v113.03,36.83 | v189.87,33.34 189.23,33.97 189.23,57.15 IC39.23
  Bottom 0.254: v112.71,44.13 IC19.9 | v113.03,36.83 113.35,36.51 133.03,36.51 134.94,34.61 165.1,34.61 166.37,33.34 172.4,33.34 172.72,33.66 189.55,33.66 v189.87,33.34 | IC38.23 212.09,57.15 197.8,57.15 196.53,58.42 IC39.23
MA1